# EAGLE design pcb (EAGLE 5.10)
DOC: N/A; PART_NO: LCD-01; PROJECT: PBX Server; REV: A; TITLE: Serial LCD Adpater
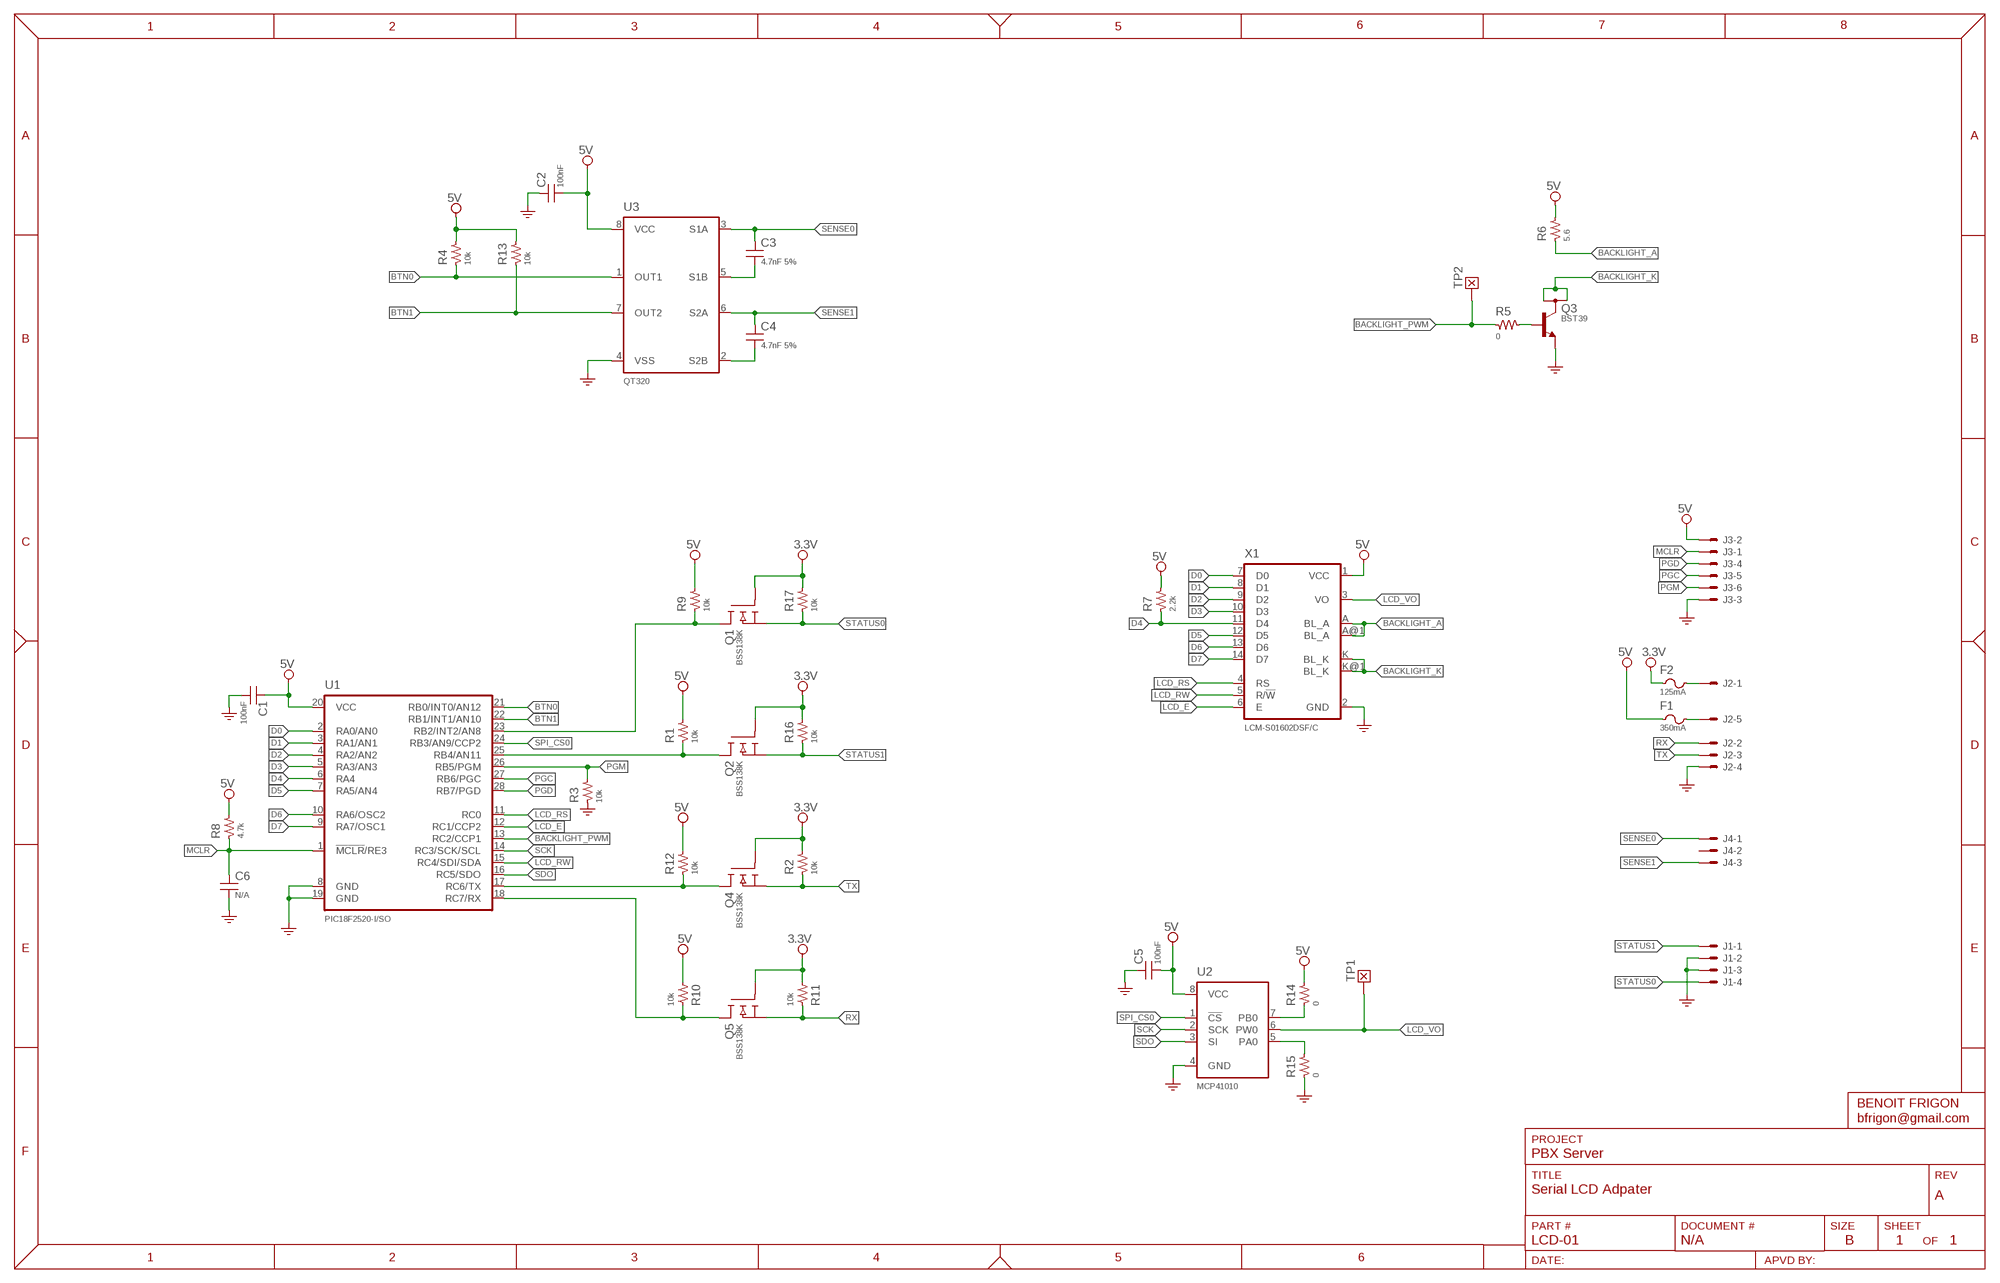
[diagram p0: schematic, sheet 1]

## Parts
C1  100nF  CAP-0603  [SMD_0603]
C2  100nF  CAP-0603  [SMD_0603]
C3  4.7nF 5%  CAP-0805  [SMD_0805]
C4  4.7nF 5%  CAP-0805  [SMD_0805]
C5  100nF  CAP-0603  [SMD_0603]
C6  N/A  CAP-0603  [SMD_0603]
F1  350mA  FUSE1206  [SMD_1206]
F2  125mA  FUSE1206  [SMD_1206]
J1  SNG-2MM-HEADER-04-SMT-V  [DF3DZ-4P-2VXX]
J2  SNG-2MM-HEADER-05-SMT-V  [DF3DZ-5P-2VXX]
J3  SNG-2MM-HEADER-06-SMT-V  [DF3DZ-6P-2VXX]
J4  SNG-2MM-HEADER-03-SMT-V  [DF3DZ-3P-2VXX]
Q1  BSS138K  [SOT23]
Q2  BSS138K  [SOT23]
Q3  BST39  [SOT89]
Q4  BSS138K  [SOT23]
Q5  BSS138K  [SOT23]
R1  10k  RES-0603  [SMD_0603]
R2  10k  RES-0603  [SMD_0603]
R3  10k  RES-0603  [SMD_0603]
R4  10k  RES-0603  [SMD_0603]
R5  0  RES-0603  [SMD_0603]
R6  5.6  RES-1206  [SMD_1206]
R7  2.2k  RES-0603  [SMD_0603]
R8  4.7k  RES-0603  [SMD_0603]
R9  10k  RES-0603  [SMD_0603]
R10  10k  RES-0603  [SMD_0603]
R11  10k  RES-0603  [SMD_0603]
R12  10k  RES-0603  [SMD_0603]
R13  10k  RES-0603  [SMD_0603]
R14  0  RES-0805  [SMD_0805]
R15  0  RES-0805  [SMD_0805]
R16  10k  RES-0603  [SMD_0603]
R17  10k  RES-0603  [SMD_0603]
TP1  Vo  TEST_POINT-050  [TP_050]
TP2  BL PWM  TEST_POINT-050  [TP_050]
U1  PIC18F2520-I/SO  [SOIC28]
U2  MCP41010  [SOIC8]
U3  QT320  [SOIC8]
X1  LCM-S01602DSF/C  [LCM-S01602DSF/C]

## Nets
3.3V: F2.1 Q1.1(G) Q2.1(G) Q4.1(G) Q5.1(G) R2.2 R11.2 R16.2 R17.2
5V: C1.1 C2.2 C5.2 F1.1 J3.2 R1.2 R4.2 R6.2 R7.2 R8.2 R9.2 R10.2 R12.2 R13.2 R14.2 U1.20(VCC) U2.8(VCC) U3.8(VCC) X1.1(VCC)
BACKLIGHT_A: R6.1 X1.A(BL_A) X1.A@1(BL_A)
BACKLIGHT_K: Q3.2(C) Q3.2@1(C) X1.K(BL_K) X1.K@1(BL_K)
BACKLIGHT_PWM: R5.1 TP2.1 U1.13(RC2/CCP1)
BTN0: R4.1 U1.21(RB0/INT0/AN12) U3.1(OUT1)
BTN1: R13.1 U1.22(RB1/INT1/AN10) U3.7(OUT2)
D0: U1.2(RA0/AN0) X1.7(D0)
D1: U1.3(RA1/AN1) X1.8(D1)
D2: U1.4(RA2/AN2) X1.9(D2)
D3: U1.5(RA3/AN3) X1.10(D3)
D4: R7.1 U1.6(RA4) X1.11(D4)
D5: U1.7(RA5/AN4) X1.12(D5)
D6: U1.10(RA6/OSC2) X1.13(D6)
D7: U1.9(RA7/OSC1) X1.14(D7)
GND: C1.2 C2.1 C5.1 C6.2 J1.2 J1.3 J2.4 J3.3 Q3.3(E) R3.1 R15.1 U1.8(GND) U1.19(GND) U2.4(GND) U3.4(VSS) X1.2(GND)
LCD_E: U1.12(RC1/CCP2) X1.6(E)
LCD_RS: U1.11(RC0) X1.4(RS)
LCD_RW: U1.15(RC4/SDI/SDA) X1.5(R/!W!)
LCD_VO: TP1.1 U2.6(PW0) X1.3(VO)
MCLR: C6.1 J3.1 R8.1 U1.1(!MCLR!/RE3)
N$1: R15.2 U2.5(PA0)
N$2: C4.2 U3.2(S2B)
N$3: Q3.1(B) R5.2
N$4: F1.2 J2.5
N$5: R14.1 U2.7(PB0)
N$6: Q2.3(D) R1.1 U1.25(RB4/AN11)
N$7: Q1.3(D) R9.1 U1.23(RB2/INT2/AN8)
N$8: F2.2 J2.1
N$17: C3.2 U3.5(S1B)
PGC: J3.5 U1.27(RB6/PGC)
PGD: J3.4 U1.28(RB7/PGD)
PGM: J3.6 R3.2 U1.26(RB5/PGM)
RX: J2.2 Q5.2(S) R11.1
RX_5V: Q5.3(D) R10.1 U1.18(RC7/RX)
SCK: U1.14(RC3/SCK/SCL) U2.2(SCK)
SDO: U1.16(RC5/SDO) U2.3(SI)
SENSE0: C3.1 J4.1 U3.3(S1A)
SENSE1: C4.1 J4.3 U3.6(S2A)
SPI_CS0: U1.24(RB3/AN9/CCP2) U2.1(!CS)
STATUS0: J1.4 Q1.2(S) R17.1
STATUS1: J1.1 Q2.2(S) R16.1
TX: J2.3 Q4.2(S) R2.1
TX_5V: Q4.3(D) R12.1 U1.17(RC6/TX)
Unconnected: J4.2

## Library data of the parts
C1 C2 C5 C6 = Passive:CAP: Capacitor; DESCRIPTION: {DESCRIPTION} - SMT 0603 - {value}; PACKAGE: SMT 0603
C3 C4 = Passive:CAP: Capacitor; DESCRIPTION: {DESCRIPTION} - SMT 0805 - {value}; PACKAGE: SMT 0805
F1 F2 = Passive:FUSE: Fuse; DESCRIPTION: {DESCRIPTION} - SMT 1206 - {VALUE}
J1 = Connectors:SNG-2MM-HEADER-04: 2mm Single Row Header - 4 pos; DESCRIPTION: {DESCRIPTION} - SMT Vertical; MFG: Hirose Electronic; SKU: DF3DZ-4P-2VXX
J2 = Connectors:SNG-2MM-HEADER-05: 2mm Single Row Header - 5 pos; DESCRIPTION: {DESCRIPTION} - SMT Vertical; MFG: Hirose Electronic; SKU: DF3DZ-5P-2VXX
J3 = Connectors:SNG-2MM-HEADER-06: 2mm Single Row Header - 6 pos; DESCRIPTION: {DESCRIPTION} - SMT Vertical; MFG: Hirose Electronic; SKU: DF3DZ-6P-2VXX
J4 = Connectors:SNG-2MM-HEADER-03: 2mm Single Row Header - 3 pos; DESCRIPTION: {DESCRIPTION} - SMT Vertical; MFG: Hirose Electronic; SKU: DF3DZ-3P-2VXX
Q1 Q2 Q4 Q5 = Transistor:BSS138: Mosfet N-Channel - 60V 0.23A - SOT-23
Q3 = Transistor:BST39: NPN Transistor - 500mA - 350V; MFG: Zetex
R1-R5 R7-R13 R16 R17 = Passive:RES: Resistor; DESCRIPTION: {DESCRIPTION} - SMT 0603 - {VALUE}; PACKAGE: SMT 0603
R6 = Passive:RES: Resistor; DESCRIPTION: {DESCRIPTION} - SMT 1206 - {VALUE}; PACKAGE: SMT 1206
R14 R15 = Passive:RES: Resistor; DESCRIPTION: {DESCRIPTION} - SMT 0805 - {VALUE}; PACKAGE: SMT 0805
TP1 TP2 = Misc:TEST_POINT; NO_BOM: 1
U1 = IC:PIC18F*520-?: Microcontroller 32k PROG / 1536 RAM / 256 EEPROM; MFG: Microchip
U2 = IC:MCP41*: Single Digital Potentiometer; DESCRIPTION: {DESCRIPTION} - 10k; MFG: Microchip
U3 = IC:QT320: 2 Channel Programmable Sensor IC; MFG: Quantum Research Group
X1 = Optoelectronic:LCM-S01602DSF/C: Alphanumeric LCD module 16x2 - Yellow B/L; MFG: Lumex

## Board
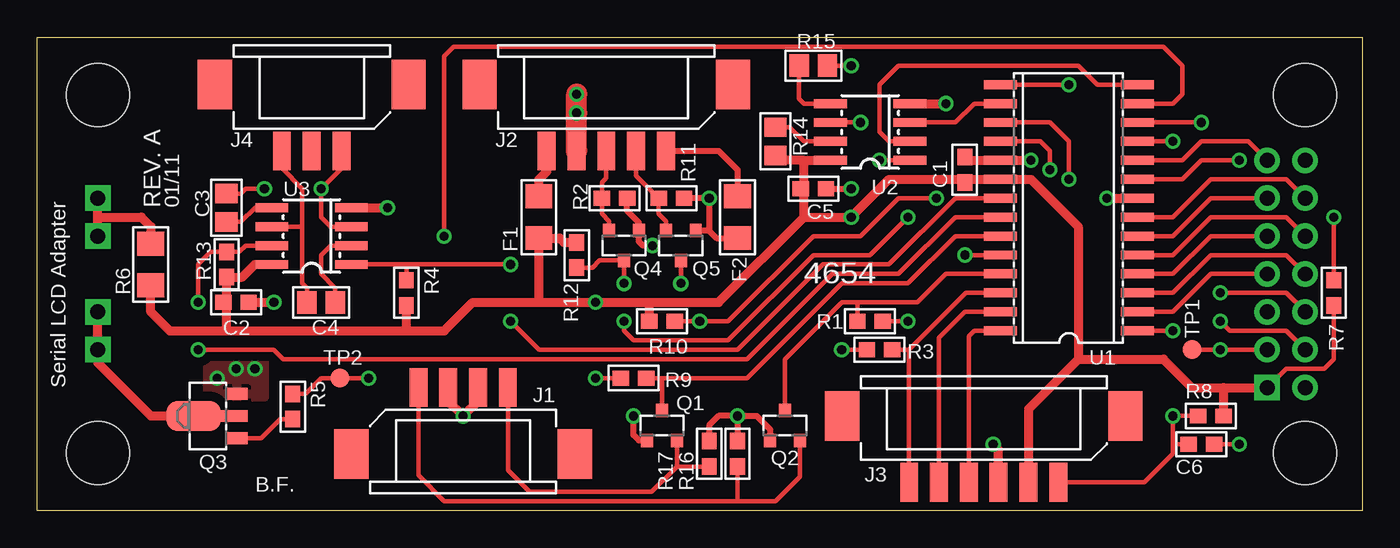
[diagram p1: board, top side]
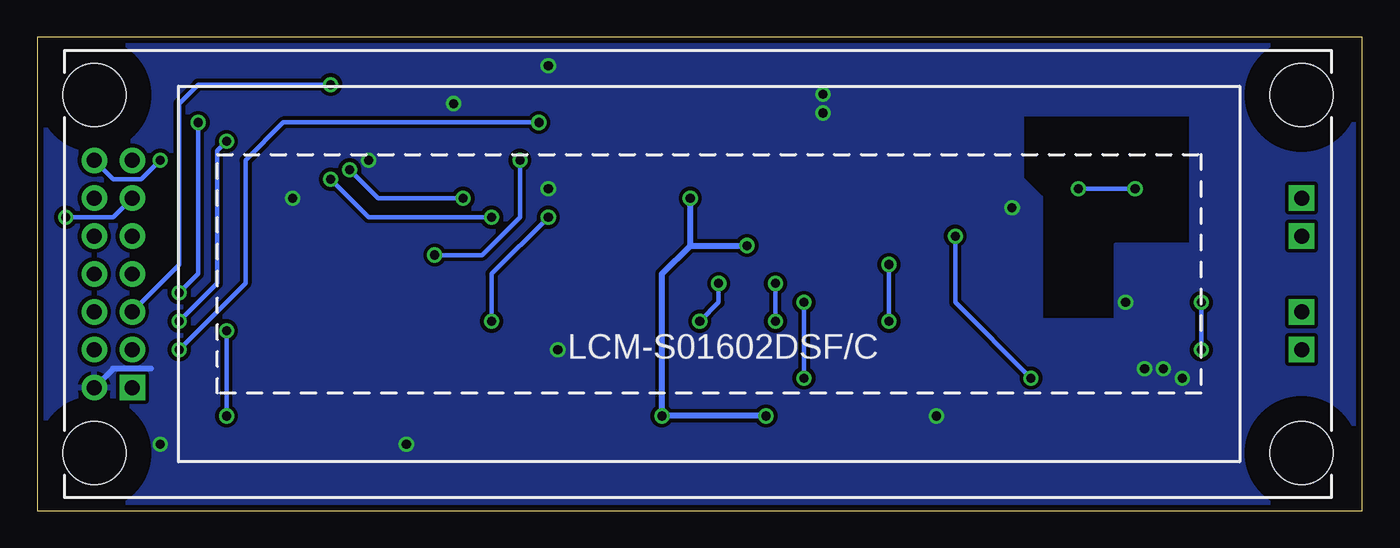
[diagram p2: board, bottom side, seen from below]

Size 88.9 x 31.75 mm. Coordinates in mm from the lower left corner, seen from the top.
Outline: 0,31.75 88.9,31.75 88.9,0 0,0 0,31.75
Copper layers (1*16): Top 0.035mm / dielectric 1.5mm / Bottom 0.035mm
Design rules "default *": minimum track width 10mil, minimum drill 24mil, track to track 8mil, track to pad 8mil, pad to pad 8mil, via to via 8mil, smd to smd 8mil, copper to edge 16mil, drill to drill 8mil, minimum pad ring 14mil, minimum via ring 8mil, stop-mask expansion 4mil, vias tented up to drill 24mil, thermal gap 10mil

### Footprints (pad centres in the part's own frame; a part is rotated, then mirrored left to right if it is on the bottom)
SMD_0603 = smd 1.1 x 1: 1 -0.85,0; 2 0.85,0
SMD_0805 = smd 1.3 x 1.5: 1 -0.95,0; 2 0.95,0
SMD_1206 = smd 1.6 x 1.8: 1 -1.4,0; 2 1.4,0
DF3DZ-4P-2VXX = smd 1.2 x 2.6: 1 3,0; 2 1,0; 3 -1,0; 4 -3,0 | smd 2.3 x 3.3: G@1 -7.5,4.45; G@2 7.5,4.45
DF3DZ-5P-2VXX = smd 1.2 x 2.6: 1 4,0; 2 2,0; 3 0,0; 4 -2,0; 5 -4,0 | smd 2.3 x 3.3: G@1 -8.5,4.45; G@2 8.5,4.45
DF3DZ-6P-2VXX = smd 1.2 x 2.6: 1 5,0; 2 3,0; 3 1,0; 4 -1,0; 5 -3,0; 6 -5,0 | smd 2.3 x 3.3: G@1 -9.5,4.45; G@2 9.5,4.45
DF3DZ-3P-2VXX = smd 1.2 x 2.6: 1 2,0; 2 0,0; 3 -2,0 | smd 2.3 x 3.3: G@1 -6.5,4.45; G@2 6.5,4.45
SOT23 = smd 0.8 x 0.9: 1 -1,-1; 2 1,-1; 3 0,1
SOT89 = smd 0.8 x 1.4: 1 -1.499,-1.981; 3 1.499,-1.981 | smd 0.8 x 1.9: 2 0,-1.727 | smd 2.032 x 3.65: 2@1 0,0.94
TP_050 = smd 1.27 x 1.27: 1 0,0
SOIC28 = smd 0.6 x 2.2: 1 -8.255,-4.6; 2 -6.985,-4.6; 3 -5.715,-4.6; 4 -4.445,-4.6; 5 -3.175,-4.6; 6 -1.905,-4.6; 7 -0.635,-4.6; 8 0.635,-4.6; 9 1.905,-4.6; 10 3.175,-4.6; 11 4.445,-4.6; 12 5.715,-4.6; 13 6.985,-4.6; 14 8.255,-4.6; 15 8.255,4.6; 16 6.985,4.6; 17 5.715,4.6; 18 4.445,4.6; 19 3.175,4.6; 20 1.905,4.6; 21 0.635,4.6; 22 -0.635,4.6; 23 -1.905,4.6; 24 -3.175,4.6; 25 -4.445,4.6; 26 -5.715,4.6; 27 -6.985,4.6; 28 -8.255,4.6
SOIC8 = smd 0.6 x 2.2: 1 -1.905,-2.667; 2 -0.635,-2.667; 3 0.635,-2.667; 4 1.905,-2.667; 5 1.905,2.667; 6 0.635,2.667; 7 -0.635,2.667; 8 -1.905,2.667
LCM-S01602DSF/C = drill 1 square: 1 -38.71,-7.62; A 39.75,2.54; A@1 39.75,5.08; K 39.75,-5.08; K@1 39.75,-2.54 | drill 1 round: 2 -41.25,-7.62; 3 -38.71,-5.08; 4 -41.25,-5.08; 5 -38.71,-2.54; 6 -41.25,-2.54; 7 -38.71,0; 8 -41.25,0; 9 -38.71,2.54; 10 -41.25,2.54; 11 -38.71,5.08; 12 -41.25,5.08; 13 -38.71,7.62; 14 -41.25,7.62 | hole 4.216: -41.25,-12; -41.25,12; 39.75,-12; 39.75,12

### Placement (x,y rotation side)
C1  62.23,22.86 90 top
C2  13.34,13.97 180 top
C3  12.7,20.32 270 top
C4  19.05,13.97 0 top
C5  52.07,21.59 180 top
C6  78.11,4.45 0 top
F1  33.66,19.68 90 top
F2  46.99,19.68 90 top
J1  28.57,8.26 180 top
J2  38.18,24.13 0 top
J3  63.5,1.91 0 top
J4  18.41,24.13 0 top
Q1  41.91,5.71 0 top
Q2  50.16,5.71 0 top
Q3  11.43,6.35 90 top
Q4  39.37,17.78 180 top
Q5  43.18,17.78 180 top
R1  55.88,12.7 0 top
R2  38.73,20.95 0 top
R3  56.52,10.79 0 top
R4  24.77,14.61 270 top
R5  17.14,6.99 270 top
R6  7.62,16.51 270 top
R7  87,14.61 270 top
R8  78.74,6.35 0 top
R9  40.01,8.89 180 top
R10  41.91,12.7 180 top
R11  42.55,20.95 0 top
R12  36.2,17.14 90 top
R13  12.7,16.51 270 top
R14  49.53,24.77 270 top
R15  52.07,29.84 180 top
R16  46.99,3.81 90 top
R17  45.09,3.81 90 top
TP1  77.47,10.79 0 top
TP2  20.32,8.89 0 top
U1  69.22,20.32 90 top
U2  55.88,25.4 90 top
U3  18.41,18.41 90 top
X1  43.81,15.88 0 bottom

### Tracks (layer width: path | path; a pad name or v marks a point on that pad's centre or on a via)
3.3V  (via drill 0.61)
  Top 0.406: R11.2 v45.09,20.95 45.09,18.78 | v46.99,6.35 45.72,6.35 45.09,5.71 R17.2 | v46.99,6.35 48.26,6.35 49.16,5.45 Q2.1 | v46.99,6.35 R16.2 | v40.01,6.35 40.01,5.08 40.37,4.71 Q1.1 | R2.2 39.59,20.11 40.37,19.32 Q4.1 40.37,18.05 40.64,17.78 v41.27,17.78 | 45.09,18.78 45.58,18.29 F2.1 | 45.09,18.78 Q5.1
  Bottom 0.406: 45.09,17.78 v45.09,20.95 | 45.09,17.78 46.99,15.88 v46.99,6.35 v40.01,6.35 | 45.09,17.78 v41.27,17.78
5V  (via drill 0.61)
  Top 0.305: X1.1 82.55,8.26 83.82,9.53 86.36,9.53 87,10.16 R7.2 | v37.47,8.89 R9.2 | v58.42,12.7 R1.2
  Top 0.406: 49.53,23.5 R14.2
  Top 0.61: 62.23,22.23 U1.20 66.67,22.23 69.85,19.05 69.85,10.16 | 62.23,22.23 C1.1 | 62.23,22.23 57.15,22.23 v54.61,19.68 51.44,19.68 | 51.44,19.68 51.44,21.59 | 51.44,21.59 51.44,23.5 | 51.44,21.59 C5.2 | 51.44,23.5 49.53,23.5 | 51.44,19.68 45.72,13.97 41.06,13.97 | 33.66,13.97 v37.47,13.97 41.06,13.97 | 41.06,13.97 R10.2 | 33.66,13.97 F1.1 35.05,18.29 35.34,18 R12.2 | 69.85,10.16 75.56,10.16 77.47,8.26 79.59,8.26 | 79.59,8.26 X1.1 | 79.59,8.26 R8.2 | 33.66,13.97 29.21,13.97 27.3,12.06 24.77,12.06 | 24.77,12.06 R4.2 | 12.7,12.06 24.77,12.06 | 12.7,12.06 12.7,13.97 | 12.7,13.97 R13.2 13.76,15.66 14.61,16.51 U3.8 | 12.7,13.97 C2.2 | 12.7,12.06 8.89,12.06 7.62,13.34 R6.2 | J3.2 66.5,6.81 69.85,10.16 | 51.44,23.5 U2.8
  Bottom 0.305: v37.47,13.97 v37.47,8.89 | v58.42,12.7 58.42,15.88 v54.61,19.68
BACKLIGHT_A
  Top 0.61: R6.1 7.62,19.05 6.99,19.68 4.07,19.68 | 4.07,19.68 X1.A@1 | X1.A 4.07,19.68
BACKLIGHT_K
  Top 0.61: X1.K@1 X1.K 4.07,9.9 7.62,6.35 Q3.2@1 Q3.2
BACKLIGHT_PWM  (via drill 0.61)
  Top 0.305: U1.13 76.2,27.3 76.83,27.94 76.83,29.84 75.56,31.11 27.94,31.11 27.3,30.48 v27.3,18.41 | v22.23,8.89 TP2.1 19.05,8.89 18,7.83 R5.1
  Bottom 0.305: v22.23,8.89 27.3,13.97 v27.3,18.41
BTN0  (via drill 0.61)
  Top 0.305: U1.21 61.59,20.95 57.15,16.51 52.7,16.51 46.99,10.79 33.66,10.79 v31.75,12.7 | U3.1 24.77,16.51 | 24.77,16.51 v31.75,16.51 | 24.77,16.51 R4.1
  Bottom 0.305: v31.75,16.51 v31.75,12.7
BTN1  (via drill 0.61)
  Top 0.305: U1.22 61.59,19.68 57.78,15.88 53.34,15.88 47.62,10.16 16.51,10.16 15.88,10.79 v10.79,10.79 | U3.7 13.97,17.78 13.55,17.36 R13.1 11.64,17.36 10.79,16.51 v10.79,13.97
  Bottom 0.305: v10.79,10.79 v10.79,13.97
D0
  Top 0.305: U1.2 76.2,13.34 78.74,15.88 X1.7
D1
  Top 0.305: U1.3 76.2,14.61 78.74,17.14 83.8,17.14 X1.8
D2
  Top 0.305: U1.4 76.2,15.88 78.74,18.41 X1.9
D3
  Top 0.305: U1.5 76.2,17.14 78.74,19.68 83.8,19.68 X1.10
D4  (via drill 0.61)
  Top 0.305: U1.6 76.2,18.41 78.74,20.95 X1.11 | v87,19.68 R7.1
  Bottom 0.305: v87,19.68 83.8,19.68 X1.11
D5
  Top 0.305: U1.7 76.2,19.68 78.74,22.23 83.8,22.23 X1.12
D6
  Top 0.305: U1.10 76.83,23.5 78.11,24.77 81.25,24.77 X1.13
D7  (via drill 0.61)
  Top 0.305: U1.9 76.83,22.23 78.11,23.5 v80.64,23.5
  Bottom 0.305: v80.64,23.5 81.92,22.23 83.8,22.23 X1.14
GND  (via drill 0.61)
  Top 0.305: R15.1 v54.61,29.84 | R3.1 v53.98,10.79 | C6.2 v80.64,4.45
  Top 0.406: C5.1 v54.61,21.59
  Top 0.61: v71.75,20.95 U1.8 | v66.67,23.5 U1.19 62.45,23.5 C1.2 | U3.4 v23.5,20.32 | C2.1 v15.88,13.97 | J3.3 64.5,4.08 v64.14,4.45 | J1.3 29.57,7.35 v28.57,6.35 27.57,7.35 J1.2 | U2.4 v60.96,27.3
  Top 1.422: v36.2,27.94 v36.2,26.67 36.2,24.15 J2.4
  Bottom 0.406: X1.2 85.06,8.28 83.82,9.53 81.28,9.53
  other vias: 14.61,9.53 13.34,9.53 12.06,8.89
  pour Bottom (isolate 0.254, rank 3): 0,31.75 11.43,31.75 11.43,17.78 16.51,17.78 16.51,12.7 21.59,12.7 21.59,20.95 22.86,22.23 22.86,31.75 88.9,31.75 88.9,0 0,0
  pour Top (isolate 0.61): 15.24,7.62 11.43,7.62 11.43,10.16 15.24,10.16
  pour Bottom: 10.16,31.75 23.5,31.75 23.5,26.67 10.16,26.67
LCD_E  (via drill 0.61)
  Top 0.305: X1.6 85.06,13.36 83.82,14.61 v79.38,14.61 | v78.11,26.04 U1.12
  Bottom 0.305: v79.38,14.61 78.11,15.88 v78.11,26.04
LCD_RS  (via drill 0.61)
  Top 0.305: X1.4 85.06,10.82 83.82,12.06 80.01,12.06 v79.38,12.7 | v76.2,24.77 U1.11
  Bottom 0.305: v79.38,12.7 76.83,15.24 76.83,24.13 v76.2,24.77
LCD_RW  (via drill 0.61)
  Top 0.305: U1.15 v69.22,28.57
  Bottom 0.305: X1.5 79.38,16.48 79.38,27.3 78.11,28.57 v69.22,28.57
LCD_VO  (via drill 0.61)
  Top 0.305: X1.3 v79.38,10.79 TP1.1 | U2.6 v55.24,26.04
  Bottom 0.305: v55.24,26.04 72.39,26.04 74.93,23.5 74.93,15.24 v79.38,10.79
MCLR  (via drill 0.61)
  Top 0.305: v76.2,12.06 U1.1 | 76.2,4.45 76.2,3.81 74.3,1.91 J3.1 | 76.2,4.45 v76.2,6.35 R8.1 | 76.2,4.45 C6.1
  Bottom 0.305: v76.2,6.35 v76.2,12.06
N$1
  Top 0.305: R15.2 51.12,27.62 51.44,27.3 U2.5
N$2
  Top 0.305: C4.2 20,14.93 19.05,15.88 19.05,17.14 19.68,17.78 U3.2
N$3
  Top 0.305: Q3.1 15.01,4.85 16.3,6.13 R5.2
N$4
  Top 0.61: J2.5 34.18,22.75 33.66,22.23 F1.2
N$5
  Top 0.305: R14.1 50.48,25.71 51.44,24.77 U2.7
N$6
  Top 0.305: U1.25 60.96,15.88 59.05,13.97 55.03,13.97 | 55.03,13.97 53.98,13.97 50.16,10.16 Q2.3 | 55.03,13.97 R1.1
N$7
  Top 0.305: U1.23 61.59,18.41 58.42,15.24 53.98,15.24 47.62,8.89 41.91,8.89 | 41.91,8.89 R9.1 | Q1.3 41.91,8.89
N$8
  Top 0.406: F2.2 46.99,22.86 45.72,24.13 J2.1
N$17
  Top 0.305: U3.5 14.61,20.32 13.65,19.37 C3.2
PGC
  Top 0.305: J3.5 60.5,11.61 62.23,13.34 U1.27
PGD
  Top 0.305: J3.4 62.5,11.7 62.87,12.06 U1.28
PGM
  Top 0.305: J3.6 58.5,10.79 | 58.5,10.79 R3.2 | 58.5,10.79 62.31,14.61 U1.26
RX
  Top 0.305: J2.2 40.18,22.47 R11.1 41.7,19.9 42.18,19.41 Q5.2
RX_5V  (via drill 0.61)
  Top 0.305: U1.18 67.31,24.77 67.94,24.13 v67.94,22.86 | v60.33,20.95 57.78,20.95 55.24,18.41 52.07,18.41 46.35,12.7 v44.45,12.7 R10.1 | v43.18,15.24 Q5.3
  Bottom 0.305: v60.33,20.95 66.04,20.95 v67.94,22.86 | v44.45,12.7 43.18,13.97 v43.18,15.24
SCK
  Top 0.305: U1.14 71.12,28.57 69.85,29.84 57.78,29.84 56.52,28.57 56.52,25.4 57.15,24.77 U2.2
SDO
  Top 0.305: U1.16 62.87,27.3 61.59,26.04 U2.3
SENSE0  (via drill 0.61)
  Top 0.305: U3.3 19.68,19.05 19.05,19.68 v19.05,21.59 20.41,22.95 J4.1 | C3.1 13.65,21.27 13.97,21.59 v15.24,21.59
  Bottom 0.305: v15.24,21.59 v19.05,21.59
SENSE1
  Top 0.305: J4.3 16.41,22.95 17.78,21.59 17.78,19.05 | 17.78,19.05 U3.6 | C4.1 18.1,14.93 17.78,15.24 17.78,19.05
SPI_CS0  (via drill 0.61)
  Top 0.305: v62.23,17.14 U1.24 | v56.52,23.5 U2.1
  Bottom 0.305: v56.52,23.5 56.52,19.68 59.05,17.14 v62.23,17.14
STATUS0
  Top 0.305: 42.91,2.96 R17.1 | 42.91,2.96 41.22,1.27 33.02,1.27 31.57,2.71 J1.4 | 42.91,2.96 Q1.2
STATUS1
  Top 0.305: 46.99,0.64 49.53,0.64 51.16,2.27 Q2.2 | 46.99,0.64 R16.1 | J1.1 25.57,2.37 27.3,0.64 46.99,0.64
TX
  Top 0.305: J2.3 38.18,22.3 37.88,22.01 R2.1 37.88,19.9 38.37,19.41 Q4.2
TX_5V  (via drill 0.61)
  Top 0.305: U1.17 67.94,26.04 69.22,24.77 v69.22,22.23 | v58.42,19.68 55.88,17.14 52.07,17.14 46.35,11.43 40.01,11.43 39.37,12.06 v39.37,12.7 | R12.1 37.25,16.3 37.73,16.78 Q4.3 v39.37,15.24
  Bottom 0.305: v58.42,19.68 66.67,19.68 v69.22,22.23 | v39.37,12.7 v39.37,15.24

### Text on the board
tPlace: REV. A | 01/11 | 4654 | Serial LCD Adapter | B.F.
bPlace: LCM-S01602DSF/C
_tsilk: R15 | R14 | J4 | J2 | R11 | U2 | C1 | U3 | C5 | REV. A | 01/11 | C3 | R2 | F1 | R6 | R4 | Q4 | Q5 | R13 | F2 | 4654 | C2 | R12 | R1 | R7 | C4 | R10 | TP1 | U1 | TP2 | R3 | R5 | Serial LCD Adapter | R9 | R8 | J1 | Q1 | Q3 | Q2 | J3 | C6 | B.F. | R17 | R16
_bsilk: LCM-S01602DSF/C